# Altium schematic sheet Float_Main_PCB.SchDoc
size A3; SheetNumber: 1; SheetTotal: 1
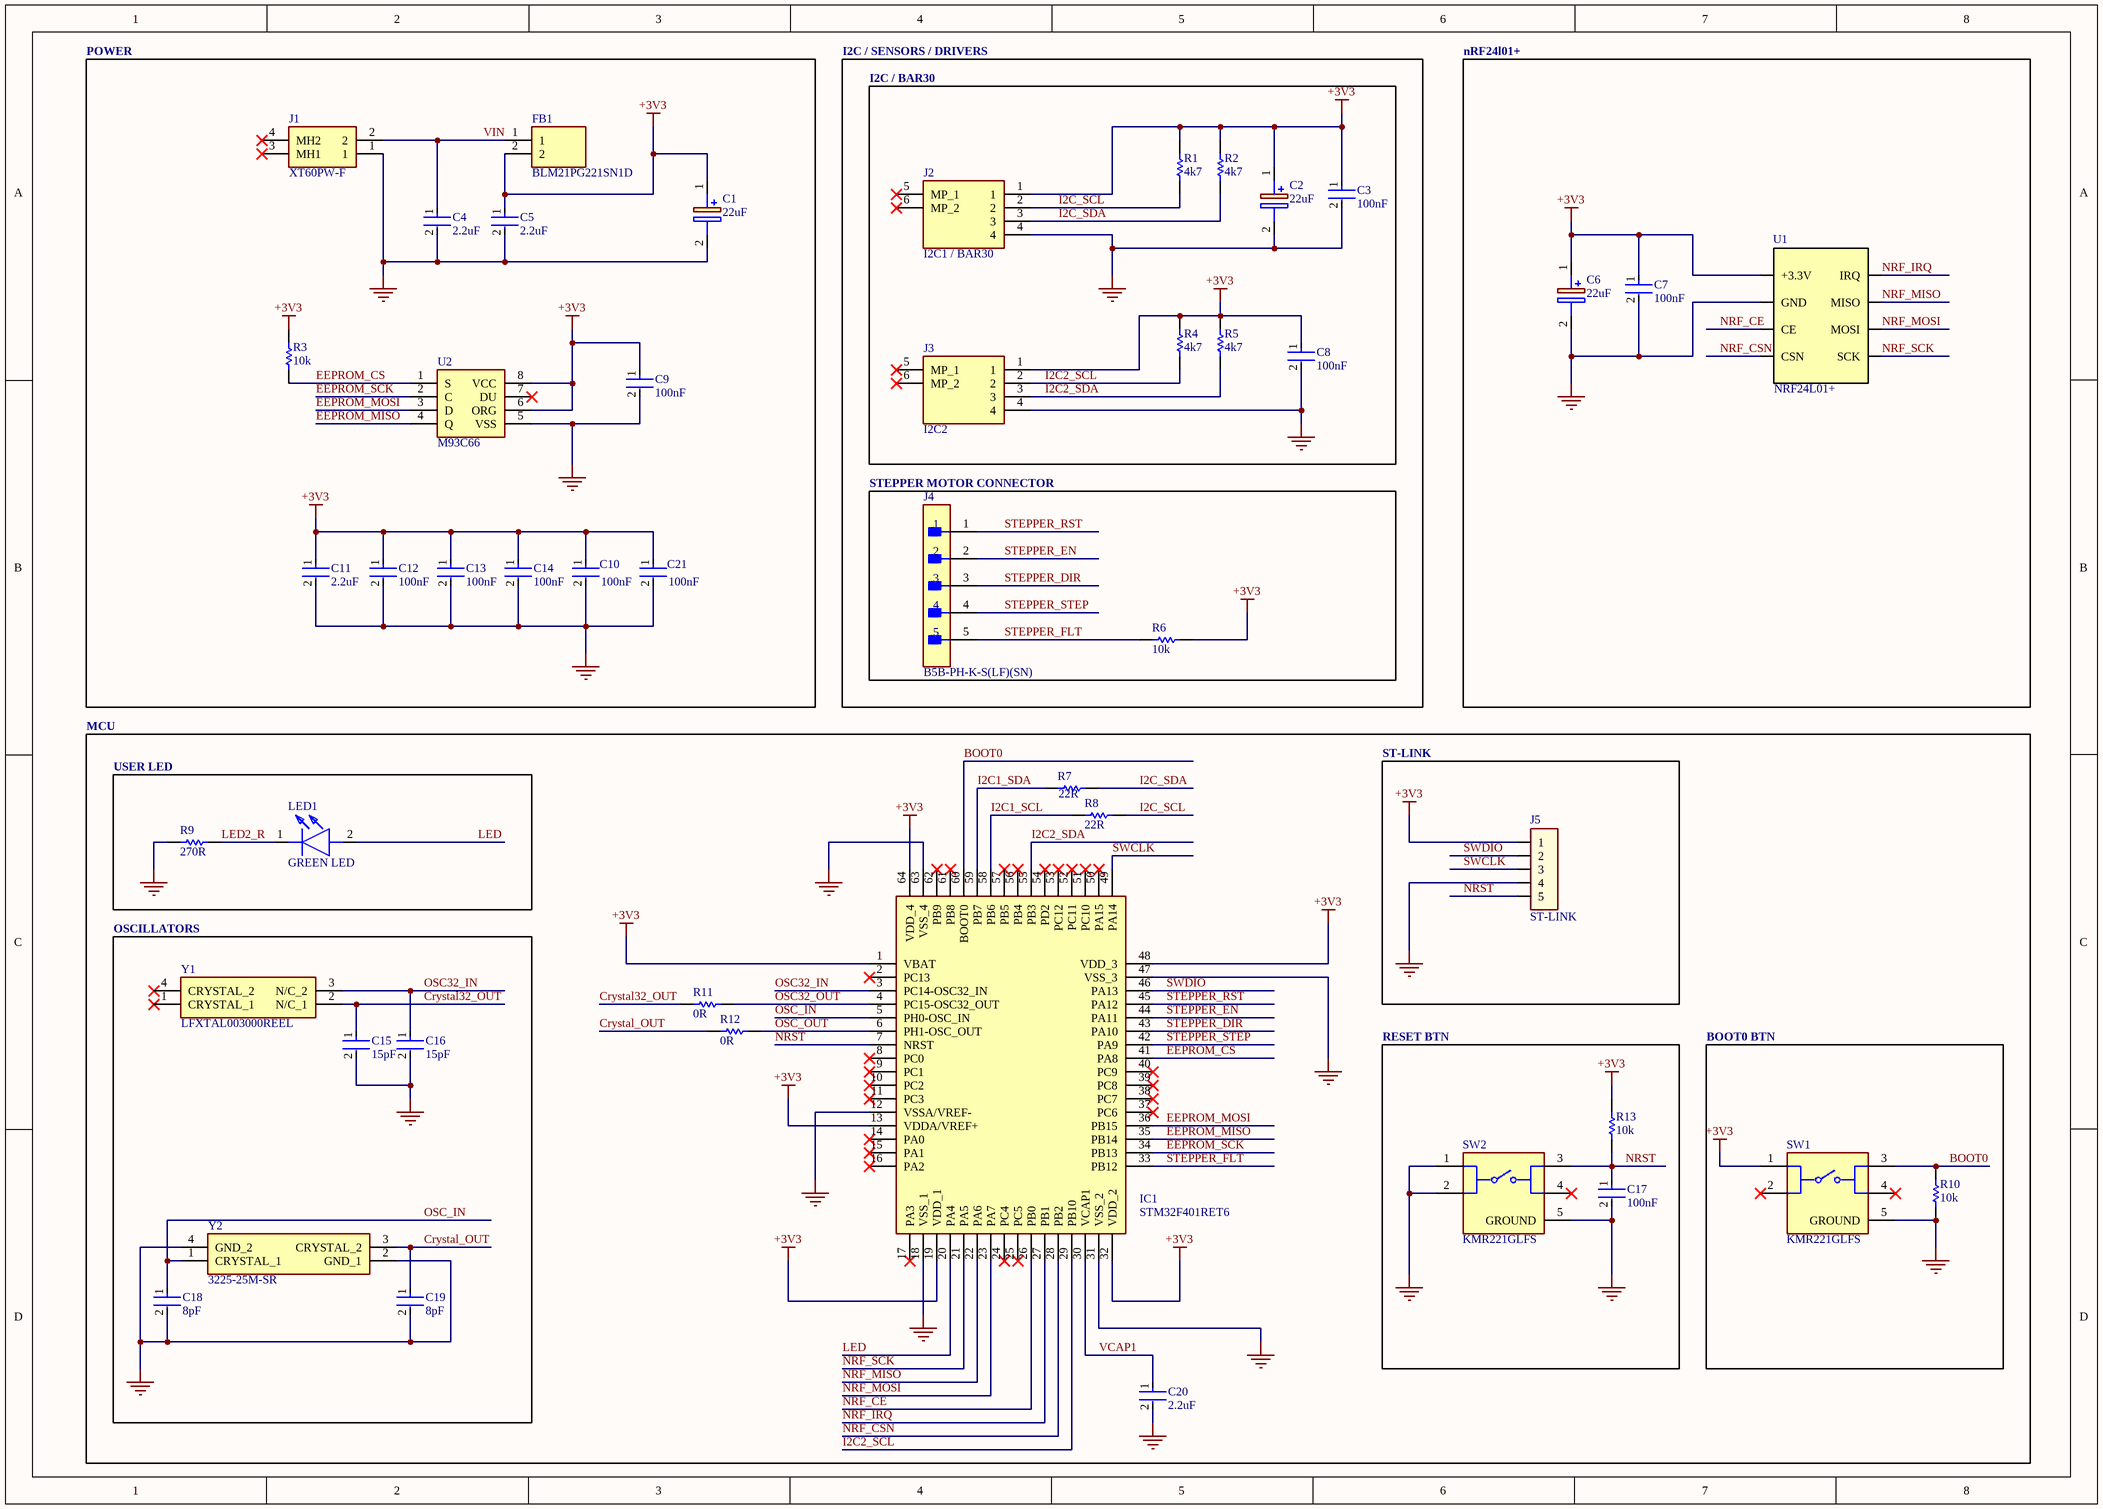
[diagram p0: Float_Main_PCB.SchDoc]

## Parts
C1  22uF  [EEE1AA220WR]
C2  22uF  [EEE1AA220WR]
C3  100nF  [FP-0805-L_2_01_0_2-W_1_25-MFG]
C4  2.2uF  [FP-0805-L_2_01_0_2-W_1_25-MFG]
C5  2.2uF  [FP-0805-L_2_01_0_2-W_1_25-MFG]
C6  22uF  [EEE1AA220WR]
C7  100nF  [FP-0805-L_2_01_0_2-W_1_25-MFG]
C8  100nF  [FP-0805-L_2_01_0_2-W_1_25-MFG]
C9  100nF  [FP-0805-L_2_01_0_2-W_1_25-MFG]
C10  100nF  [FP-0805-L_2_01_0_2-W_1_25-MFG]
C11  2.2uF  [FP-0805-L_2_01_0_2-W_1_25-MFG]
C12  100nF  [FP-0805-L_2_01_0_2-W_1_25-MFG]
C13  100nF  [FP-0805-L_2_01_0_2-W_1_25-MFG]
C14  100nF  [FP-0805-L_2_01_0_2-W_1_25-MFG]
C15  15pF  [FP-0805-L_2_01_0_2-W_1_25-MFG]
C16  15pF  [FP-0805-L_2_01_0_2-W_1_25-MFG]
C17  100nF  [FP-0805-L_2_01_0_2-W_1_25-MFG]
C18  8pF  [FP-0805-L_2_01_0_2-W_1_25-MFG]
C19  8pF  [FP-0805-L_2_01_0_2-W_1_25-MFG]
C20  2.2uF  [FP-0805-L_2_01_0_2-W_1_25-MFG]
C21  100nF  [FP-0805-L_2_01_0_2-W_1_25-MFG]
FB1  BLM21PG221SN1D  [BEADC2012X105N]
IC1  STM32F401RET6  [QFP50P1200X1200X160-64N]
J1  XT60PW-F  [XT60PWF]
J2  I2C1 / BAR30  [SM04BGHSTBLFSN]
J3  I2C2  [SM04BGHSTBLFSN]
J4  B5B-PH-K-S(LF)(SN)  [FP-B5B-PH-K-S_LF_SN-MFG]
J5  ST-LINK  [goldpin5]
LED1  GREEN LED  [LEDC2012X80N]
R1  4k7  [RESC2013X60X35ML10T20]
R2  4k7  [RESC2013X60X35ML10T20]
R3  10k  [RESC2013X60X35ML10T20]
R4  4k7  [RESC2013X60X35ML10T20]
R5  4k7  [RESC2013X60X35ML10T20]
R6  10k  [RESC2013X60X35ML10T20]
R7  22R  [RESC2013X60X35ML10T20]
R8  22R  [RESC2013X60X35ML10T20]
R9  270R  [RESC2013X60X35ML10T20]
R10  10k  [RESC2013X60X35ML10T20]
R11  0R  [RESC2013X60X35ML10T20]
R12  0R  [RESC2013X60X35ML10T20]
R13  10k  [RESC2013X60X35ML10T20]
SW1  KMR221GLFS  [FP-KMR221GLFS-MFG]
SW2  KMR221GLFS  [FP-KMR221GLFS-MFG]
U1  NRF24L01+ SMD  [PCBComponent_1]  (value not drawn)
U2  M93C66  [SOIC127P600X175-8N]
Y1  LFXTAL003000REEL  [LFXTAL003000REEL]
Y2  3225-25M-SR  [322525MSR]

## Blocks framed on the sheet
POWER: C1 C4 C5 C9-C14 C21 FB1 J1 R3 U2
nRF24l01+: C6 C7 U1
I2C / BAR30: C2 C3 C8 J2 J3 R1 R2 R4 R5
STEPPER MOTOR CONNECTOR: J4 R6
MCU: C20 IC1 R7 R8 R11 R12
USER LED: LED1 R9
ST-LINK: J5
OSCILLATORS: C15 C16 C18 C19 Y1 Y2
RESET BTN: C17 R13 SW2
BOOT0 BTN: R10 SW1

## Nets
+3V3: C1.1(+) C2.1(+) C3.1 C5.1 C6.1(+) C7.1 C8.1 C9.1 C10.1 C11.1 C12.1 C13.1 C14.1 C21.1 FB1.2 IC1.1(VBAT) IC1.13(VDDA/VREF+) IC1.19(VDD_1) IC1.32(VDD_2) IC1.48(VDD_3) IC1.64(VDD_4) J2.1 J3.1 J5.1 R1.2 R2.1 R3.1 R4.2 R5.1 R6.1 R13.2 SW1.1 U1.1(+3.3V) U2.6(ORG) U2.8(VCC)
GND: C1.2(-) C2.2(-) C3.2 C4.2 C5.2 C6.2(-) C7.2 C8.2 C9.2 C10.2 C11.2 C12.2 C13.2 C14.2 C15.2 C16.2 C17.2 C18.2 C19.2 C20.2 C21.2 IC1.12(VSSA/VREF-) IC1.18(VSS_1) IC1.31(VSS_2) IC1.47(VSS_3) IC1.63(VSS_4) J1.1 J2.4 J3.4 J5.4 R9.1 R10.2 SW1.5(GROUND) SW2.1 SW2.2 SW2.5(GROUND) U1.2(GND) U2.5(VSS) Y2.2(GND_1) Y2.4(GND_2)
BOOT0: IC1.60(BOOT0) R10.1 SW1.3
Crystal32_OUT: C15.1 R11.1 Y1.2(N/C_1)
Crystal_OUT: C19.1 R12.2 Y2.3(CRYSTAL_2)
EEPROM_CS: IC1.41(PA8) R3.2 U2.1(S)
EEPROM_MISO: IC1.35(PB14) U2.4(Q)
EEPROM_MOSI: IC1.36(PB15) U2.3(D)
EEPROM_SCK: IC1.34(PB13) U2.2(C)
I2C1_SCL: IC1.58(PB6) R8.2
I2C1_SDA: IC1.59(PB7) R7.2
I2C2_SCL: IC1.29(PB10) J3.2 R4.1
I2C2_SDA: IC1.55(PB3) J3.3 R5.2
I2C_SCL: J2.2 R1.1 R8.1
I2C_SDA: J2.3 R2.2 R7.1
LED: IC1.20(PA4) LED1.2(A)
LED2_R: LED1.1(K) R9.2
NRF_CE: IC1.26(PB0) U1.3(CE)
NRF_CSN: IC1.28(PB2) U1.4(CSN)
NRF_IRQ: IC1.27(PB1) U1.8(IRQ)
NRF_MISO: IC1.22(PA6) U1.7(MISO)
NRF_MOSI: IC1.23(PA7) U1.6(MOSI)
NRF_SCK: IC1.21(PA5) U1.5(SCK)
NRST: C17.1 IC1.7(NRST) J5.5 R13.1 SW2.3
OSC32_IN: C16.1 IC1.3(PC14-OSC32_IN) Y1.3(N/C_2)
OSC32_OUT: IC1.4(PC15-OSC32_OUT) R11.2
OSC_IN: C18.1 IC1.5(PH0-OSC_IN) Y2.1(CRYSTAL_1)
OSC_OUT: IC1.6(PH1-OSC_OUT) R12.1
STEPPER_DIR: IC1.43(PA10) J4.3
STEPPER_EN: IC1.44(PA11) J4.2
STEPPER_FLT: IC1.33(PB12) J4.5 R6.2
STEPPER_RST: IC1.45(PA12) J4.1
STEPPER_STEP: IC1.42(PA9) J4.4
SWCLK: IC1.49(PA14) J5.3
SWDIO: IC1.46(PA13) J5.2
VCAP1: C20.1 IC1.30(VCAP1)
VIN: C4.1 FB1.1 J1.2

Not connected (* = marked no-connect by the designer): IC1 2(PC13)* 8(PC0)* 9(PC1)* 10(PC2)* 11(PC3)* 14(PA0)* 15(PA1)* 16(PA2)* 17(PA3)* 24(PC4)* 25(PC5)* 37(PC6)* 38(PC7)* 39(PC8)* 40(PC9)* 50(PA15)* 51(PC10)* 52(PC11)* 53(PC12)* 54(PD2)* 56(PB4)* 57(PB5)* 61(PB8)* 62(PB9)*; J1 3(MH1)* 4(MH2)*; J2 5(MP_1)* 6(MP_2)*; J3 5(MP_1)* 6(MP_2)*; SW1 2* 4*; SW2 4*; U2 7(DU)*; Y1 1(CRYSTAL_1)* 4(CRYSTAL_2)*

## Notes on the sheet
- I2C / SENSORS / DRIVERS
- (in symbol NRF24L01+ SMD) NRF24L01+

## Library data of the parts
C1 C2 C6 = EEE1CA100SR: Capacitor Polarised; Manufacturer_Name: Panasonic; Datasheet Link: http://industrial.panasonic.com/cdbs/www-data/pdf/RDE0000/ABA0000C1145.pdf; Height: 5.5mm; Manufacturer_Part_Number: EEE1CA100SR; Arrow Part Number: EEE1CA100SR; Arrow Price/Stock: https://www.arrow.com/en/products/eee-1ca100sr/panasonic
C3 C7-C10 C12-C21 = CMP-1036-04738-3: Voltage Rating: 10V; Tolerance: 10%; Capacitance: 100n; Dissipation Factor: 5%; Dielectric: X7R; Insulation Resistance: 100GR; RoHS Compliant: Yes; Case/Package: 0805; Termination: SMD/SMT; Contact Plating: Tin; Package Quantity: 1; Packaging: Tape and Reel; Series: -; Depth: 1.25mm; Number of Pins: 2; Construction: Flat; Mount: Surface Mount; Voltage: 10V; Radiation Hardening: No; Case Code (Metric): 2012; Case Code (Imperial): 0805; Height: 1.4mm; Thickness: 0.055inch; REACH SVHC: No SVHC; Size: 1.4mm; Max Operating Temperature: 125°C; Lead Free: Lead Free; Length: 2.01mm; Voltage Rating (DC): 10V; Min Operating Temperature: -55°C; Width: 1.25mm
C4 C5 C11 = CMP-1036-04738-3: Voltage Rating: 10V; Tolerance: 10%; Capacitance: 2.2u; Dissipation Factor: 5%; Dielectric: X7R; Insulation Resistance: 100GR; RoHS Compliant: Yes; Case/Package: 0805; Termination: SMD/SMT; Contact Plating: Tin; Package Quantity: 1; Packaging: Tape and Reel; Series: -; Depth: 1.25mm; Number of Pins: 2; Construction: Flat; Mount: Surface Mount; Voltage: 10V; Radiation Hardening: No; Case Code (Metric): 2012; Case Code (Imperial): 0805; Height: 1.4mm; Thickness: 0.055inch; REACH SVHC: No SVHC; Size: 1.4mm; Max Operating Temperature: 125°C; Lead Free: Lead Free; Length: 2.01mm; Voltage Rating (DC): 10V; Min Operating Temperature: -55°C; Width: 1.25mm
FB1 = BLM21PG221SN1D: Ferrite Bead; Manufacturer_Name: Murata Electronics; Datasheet Link: https://datasheet.datasheetarchive.com/originals/dk/DKDS-31/605570.pdf; Height: 1.05mm; Manufacturer_Part_Number: BLM21PG221SN1D; Mouser Part Number: 81-BLM21P221SG; Mouser Price/Stock: https://www.mouser.co.uk/ProductDetail/Murata-Electronics/BLM21PG221SN1D?qs=N%2FLoXOA9PTJ4i6RHFrsqmw%3D%3D; Arrow Part Number: BLM21PG221SN1D; Arrow Price/Stock: https://www.arrow.com/en/products/blm21pg221sn1d/murata-manufacturing?utm_currency=USD&region=europe
IC1 = STM32F401RET6: Integrated Circuit; Manufacturer_Name: STMicroelectronics; Datasheet Link: http://www.st.com/st-web-ui/static/active/en/resource/technical/document/datasheet/DM00102166.pdf; Height: 1.6mm; Manufacturer_Part_Number: STM32F401RET6; Mouser Part Number: 511-STM32F401RET6; Mouser Price/Stock: https://www.mouser.co.uk/ProductDetail/STMicroelectronics/STM32F401RET6?qs=s5SkPsIz108eLldhTu8INg%3D%3D; Arrow Part Number: STM32F401RET6; Arrow Price/Stock: https://www.arrow.com/en/products/stm32f401ret6/stmicroelectronics?utm_currency=USD&region=nac
J1 = XT60PW-F: Connector; Manufacturer_Name: Amass; Datasheet Link: https://www.tme.eu/Document/1191bc2fa3aee3c446e5a895fd8f7983/XT60PW-F.pdf; Height: 8.4mm; Manufacturer_Part_Number: XT60PW-F
J2 J3 = SM04B-GHS-TB__LF__SN_: Connector; Manufacturer_Name: JST (JAPAN SOLDERLESS TERMINALS); Manufacturer_Part_Number: SM04B-GHS-TB (LF)(SN); Datasheet Link: https://www.jst-mfg.com/product/pdf/eng/eGH.pdf?688ae3895614e; Height: 4.35mm; Arrow Part Number: SM04B-GHS-TB (LF)(SN); Arrow Price/Stock: https://www.arrow.com/en/products/sm04b-ghs-tb-lf-sn-/jst-manufacturing?utm_currency=USD&region=europe
J4 = CMP-2000-05908-2: CONN HEADER VERT 5POS 2MM; Voltage Rating (AC): 100V; Number of Positions: 5; Contact Resistance: 20mR; Insulation Resistance: 1MR; Current Rating: 2A; Gender: Male; Mated Stacking Heights: 8mm; Series: PH; Number of Poles: 5; Width: 4.5mm; Insulation Color: Natural; Fastening Type: Detent; Flammability Rating: UL94 V-0; Mount: Through Hole; Lead Free: Lead Free; Number of Rows: 1; REACH SVHC: No SVHC; Max Voltage Rating (AC): 100V; Contact Mating Length: 0.13inch; Contact Plating: Tin; Housing Material: Polyamide; Depth: 4.5mm; Contact Type: Male Pin; Voltage Rating: 100V; Color: Natural; Housing Color: White; Lead Pitch: 2mm; Number of Contacts: 5; Orientation: Straight; Packaging: Bulk; Contact Material: Brass; Pitch: 2mm; Insulation Material: Nylon; Connector Type: Header; Contact Finish - Mating: TIN; Termination: Solder; Number of Pins: 5; Length: 11.9mm; Contact Shape: Square; Max Current Rating: 2A; Working Voltage: 100V; Min Operating Temperature: -25°C; Max Operating Temperature: 85°C; Material: Polyamide; Height: 9.4mm
J5 = CMP-008-000005-1: Design Item ID: goldpin_5; Source: goldpin.SchLib
LED1 = HSMG-C170: LED; Manufacturer_Name: Avago Technologies; Datasheet Link: https://datasheet.datasheetarchive.com/originals/distributors/SFDatasheet-4/sf-00083853.pdf; Height: 0.8mm; Manufacturer_Part_Number: HSMG-C170; Mouser Part Number: 630-HSMG-C170; Mouser Price/Stock: https://www.mouser.co.uk/ProductDetail/Broadcom-Avago/HSMG-C170?qs=YDL0qNrpDT4lm8ArMPkMEA%3D%3D
R1-R13 = CMP-2100-03671-1: Manufacturer: Yageo; Temperature Coefficient: 100ppm/degreesC; Voltage Rating (DC): 150V; Max Power Dissipation: 125mW; Resistance: 1KOhm; Tolerance: 1%; Number of Pins: 2; Number of Terminations: 2; Datasheet URL: http://www.yageo.com/NewPortal/yageodocoutput?fileName=/pdf/R-Chip/PYu-RC_Group_51_RoHS_L_5.pdf; Length: 0.079inch; Package Description: 2-Pin Surface Mounted Device, Body 2 x 1.25 mm; Depth: 1.25mm; Height: 0.024inch; Military Standard: Not; Case/Package: 0805; Package Reference: 0805; RoHSCompliant: true; Lead Free: LeadFree; Packaging: TapeandReel; Package Quantity: 1; Datasheet Version: Rev. 5, 10/2016; Min Operating Temperature: -55degC; Voltage Rating: 150V; Composition: ThickFilm; Case Code (Imperial): 0805; Power Rating: 125mW; Width: 0.049inch; Case Code (Metric): 2012; Manufacturer URL: http://www.yageo.com/; Max Operating Temperature: 155degC; REACH SVHC: Unknown; Termination: SMD/SMT
SW1 SW2 = CMP-10040-000018-1: SWITCH TACTILE SPST-NO 0.05A 32V; Illumination Type: Non-Illuminated; Contact Resistance: 100mR; Power Rating: 1W; Actuator Type: Standard; Operating Force: 2N; Max Current Rating: 50mA; Switch Function: Off-Mom; Switch Travel: 0.25mm; Actuator Length: 0.5mm; Mechanical Life: 200000Cycles; Throw Configuration: SPST; Length: 2.8mm; Max Voltage Rating (DC): 32V; Depth: 4.6mm; Orientation: Straight; Max Operating Temperature: 85°C; Packaging: Tape and Reel; Voltage Rating (DC): 32V; Width: 2.8mm; Termination: Gull Wing; Contact Plating: Silver; Case/Package: SMD/SMT; Contact Current Rating: 50mA; Mount: Surface Mount; Current Rating: 50mA; REACH SVHC: No SVHC; Lead Free: Lead Free; Radiation Hardening: No; Package Quantity: 1; Contact Material: Silver; Min Operating Temperature: -40°C
U2 = M93C66-WMN6TP: Integrated Circuit; Manufacturer_Name: STMicroelectronics; Datasheet Link: http://www.st.com/st-web-ui/static/active/en/resource/technical/document/datasheet/CD00001142.pdf; Height: 1.75mm; Manufacturer_Part_Number: M93C66-WMN6TP; Mouser Part Number: 511-M93C66-WMN6TP; Mouser Price/Stock: https://www.mouser.co.uk/ProductDetail/STMicroelectronics/M93C66-WMN6TP?qs=OMlU9E68qqQmdZ2%252BtP%2FZLw%3D%3D; Arrow Part Number: M93C66-WMN6TP; Arrow Price/Stock: https://www.arrow.com/en/products/m93c66-wmn6tp/stmicroelectronics
Y1 = LFXTAL003000REEL: Crystal or Oscillator; Manufacturer_Name: IQD; Datasheet Link: https://www.iqdfrequencyproducts.com/products/pn/LFXTAL003000.pdf; Height: 2.5mm; Manufacturer_Part_Number: LFXTAL003000REEL; Mouser Part Number: 449-LFXTAL003000REEL; Mouser Price/Stock: https://www.mouser.co.uk/ProductDetail/IQD/LFXTAL003000Reel?qs=GJ%2F2ZGcr5uOHwN9t8Hha8Q%3D%3D; Arrow Part Number: LFXTAL003000REEL; Arrow Price/Stock: https://www.arrow.com/en/products/lfxtal003000reel/iqd-frequency-products?region=europe
Y2 = 3225-25M-SR: Crystal or Oscillator; Manufacturer_Name: SRPASSIVES; Datasheet Link: https://www.tme.eu/Document/9cb2d0edad968d8543e7bc99995fd180/3235.pdf; Height: 0.7mm; Manufacturer_Part_Number: 3225-25M-SR